# EAGLE design megatemp (EAGLE 6.1)
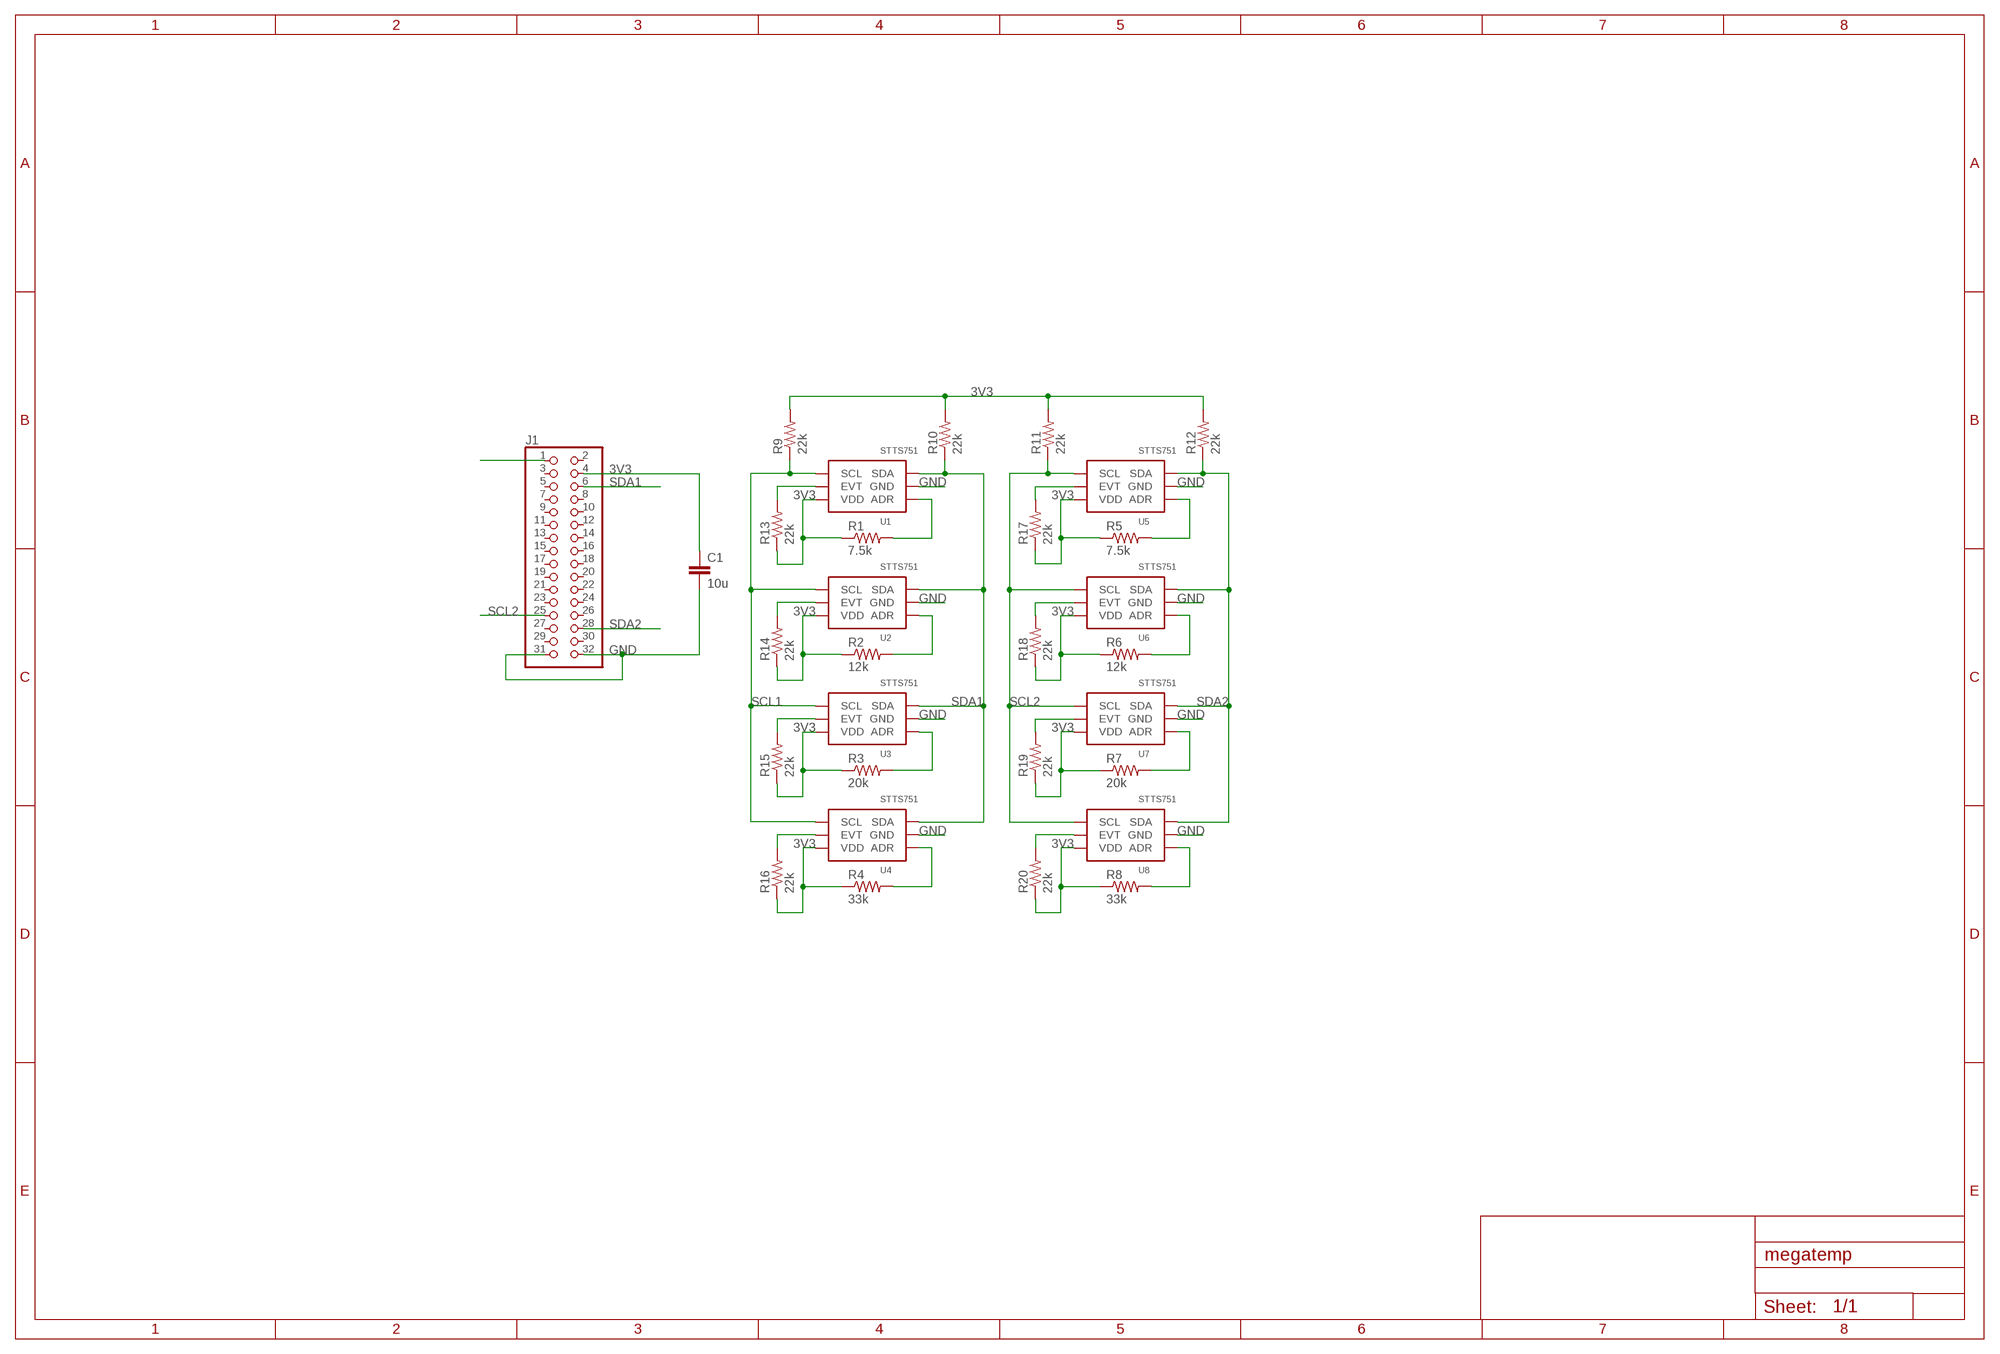
[diagram p0: schematic, sheet 1]

## Parts
C1  10u  C-EUC0805  [C0805]
J1  PINHD-2X16  [2X16]
R1  7.5k  R-US_R0402  [R0402]
R2  12k  R-US_R0402  [R0402]
R3  20k  R-US_R0402  [R0402]
R4  33k  R-US_R0402  [R0402]
R5  7.5k  R-US_R0402  [R0402]
R6  12k  R-US_R0402  [R0402]
R7  20k  R-US_R0402  [R0402]
R8  33k  R-US_R0402  [R0402]
R9  22k  R-US_R0402  [R0402]
R10  22k  R-US_R0402  [R0402]
R11  22k  R-US_R0402  [R0402]
R12  22k  R-US_R0402  [R0402]
R13  22k  R-US_R0402  [R0402]
R14  22k  R-US_R0402  [R0402]
R15  22k  R-US_R0402  [R0402]
R16  22k  R-US_R0402  [R0402]
R17  22k  R-US_R0402  [R0402]
R18  22k  R-US_R0402  [R0402]
R19  22k  R-US_R0402  [R0402]
R20  22k  R-US_R0402  [R0402]
U1  STTS751  [ST_UDFN-6L_2X2]
U2  STTS751  [ST_UDFN-6L_2X2]
U3  STTS751  [ST_UDFN-6L_2X2]
U4  STTS751  [ST_UDFN-6L_2X2]
U5  STTS751  [ST_UDFN-6L_2X2]
U6  STTS751  [ST_UDFN-6L_2X2]
U7  STTS751  [ST_UDFN-6L_2X2]
U8  STTS751  [ST_UDFN-6L_2X2]

## Nets
3V3: C1.1 J1.4 R1.1 R2.1 R3.1 R4.1 R5.1 R6.1 R7.1 R8.1 R9.2 R10.2 R11.2 R12.2 R13.1 R14.1 R15.1 R16.1 R17.1 R18.1 R19.1 R20.1 U1.3(VDD) U2.3(VDD) U3.3(VDD) U4.3(VDD) U5.3(VDD) U6.3(VDD) U7.3(VDD) U8.3(VDD)
GND: C1.2 J1.31 J1.32 U1.5(GND) U2.5(GND) U3.5(GND) U4.5(GND) U5.5(GND) U6.5(GND) U7.5(GND) U8.5(GND)
N$1: R13.2 U1.2(EVT)
N$2: R1.2 U1.4(ADR)
N$3: R2.2 U2.4(ADR)
N$4: R20.2 U8.2(EVT)
N$6: R3.2 U3.4(ADR)
N$7: R14.2 U2.2(EVT)
N$8: R4.2 U4.4(ADR)
N$9: R15.2 U3.2(EVT)
N$10: R8.2 U8.4(ADR)
N$11: R16.2 U4.2(EVT)
N$12: R7.2 U7.4(ADR)
N$13: R6.2 U6.4(ADR)
N$15: R19.2 U7.2(EVT)
N$16: R5.2 U5.4(ADR)
N$17: R18.2 U6.2(EVT)
N$18: R17.2 U5.2(EVT)
SCL1: J1.1 R9.1 U1.1(SCL) U2.1(SCL) U3.1(SCL) U4.1(SCL)
SCL2: J1.25 R11.1 U5.1(SCL) U6.1(SCL) U7.1(SCL) U8.1(SCL)
SDA1: J1.6 R10.1 U1.6(SDA) U2.6(SDA) U3.6(SDA) U4.6(SDA)
SDA2: J1.28 R12.1 U5.6(SDA) U6.6(SDA) U7.6(SDA) U8.6(SDA)
Unconnected: J1.2 J1.3 J1.5 J1.7 J1.8 J1.9 J1.10 J1.11 J1.12 J1.13 J1.14 J1.15 J1.16 J1.17 J1.18 J1.19 J1.20 J1.21 J1.22 J1.23 J1.24 J1.26 J1.27 J1.29 J1.30

## Library data of the parts
C1 = resistor:C-EU: CAPACITOR, European symbol
J1 = pinhead:PINHD-2X16: PIN HEADER
R1-R20 = resistor:R-US_: RESISTOR, American symbol
U1-U8 = megatemp:STTS751: ST STTS751 I2C Temperature Sensor

## Board
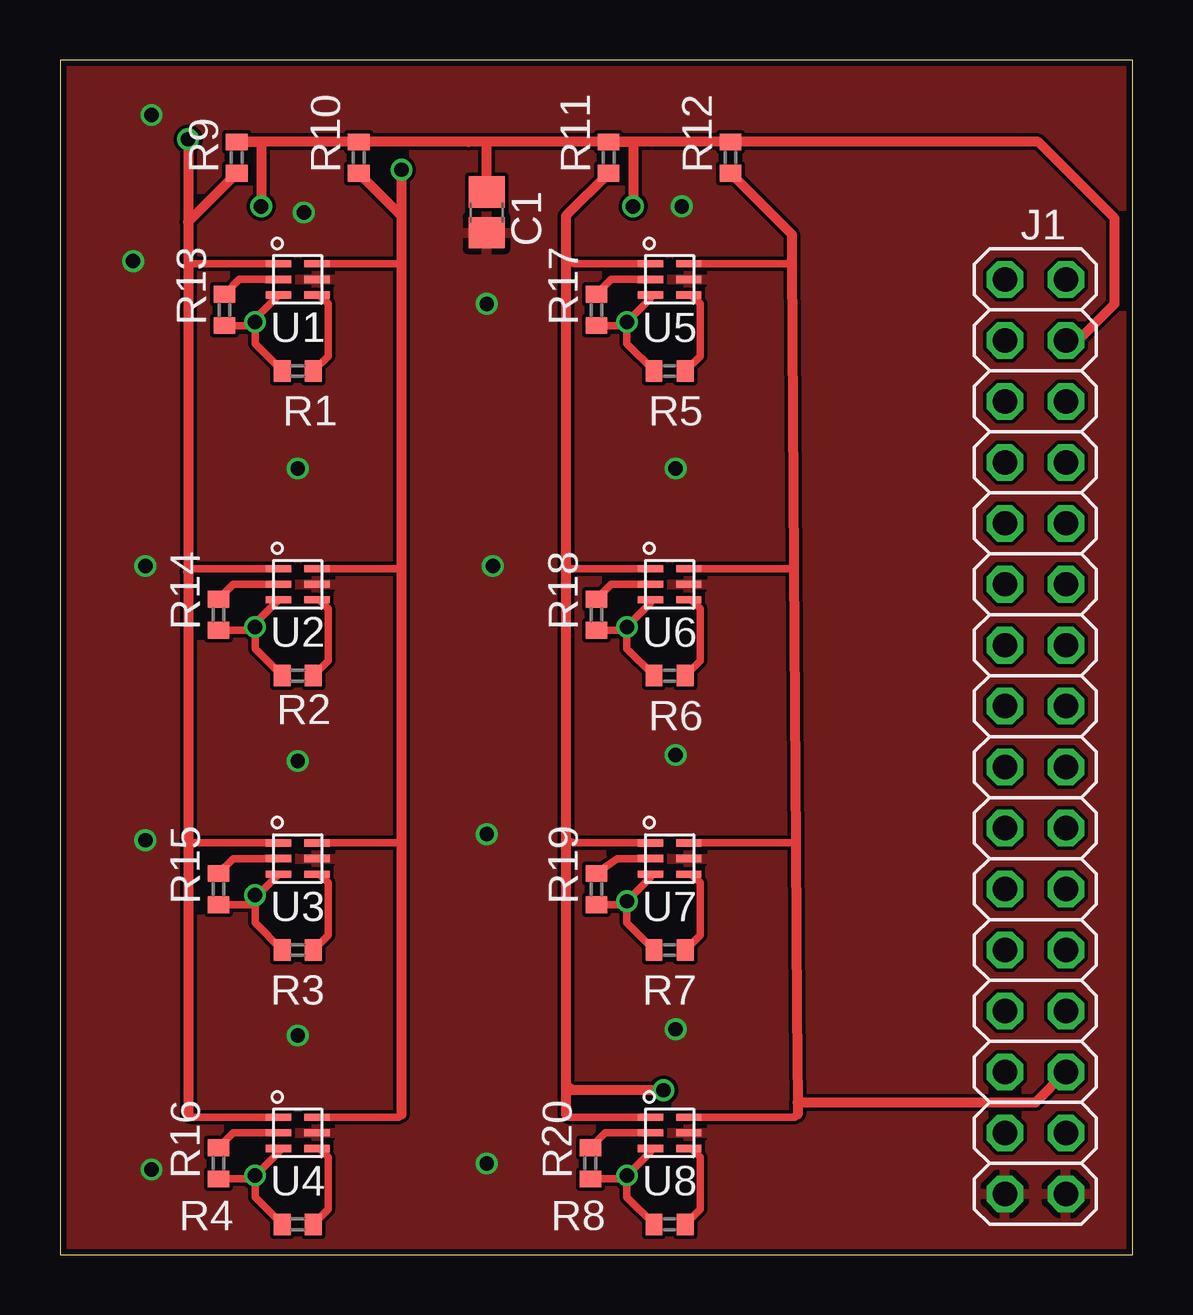
[diagram p1: board, top side]
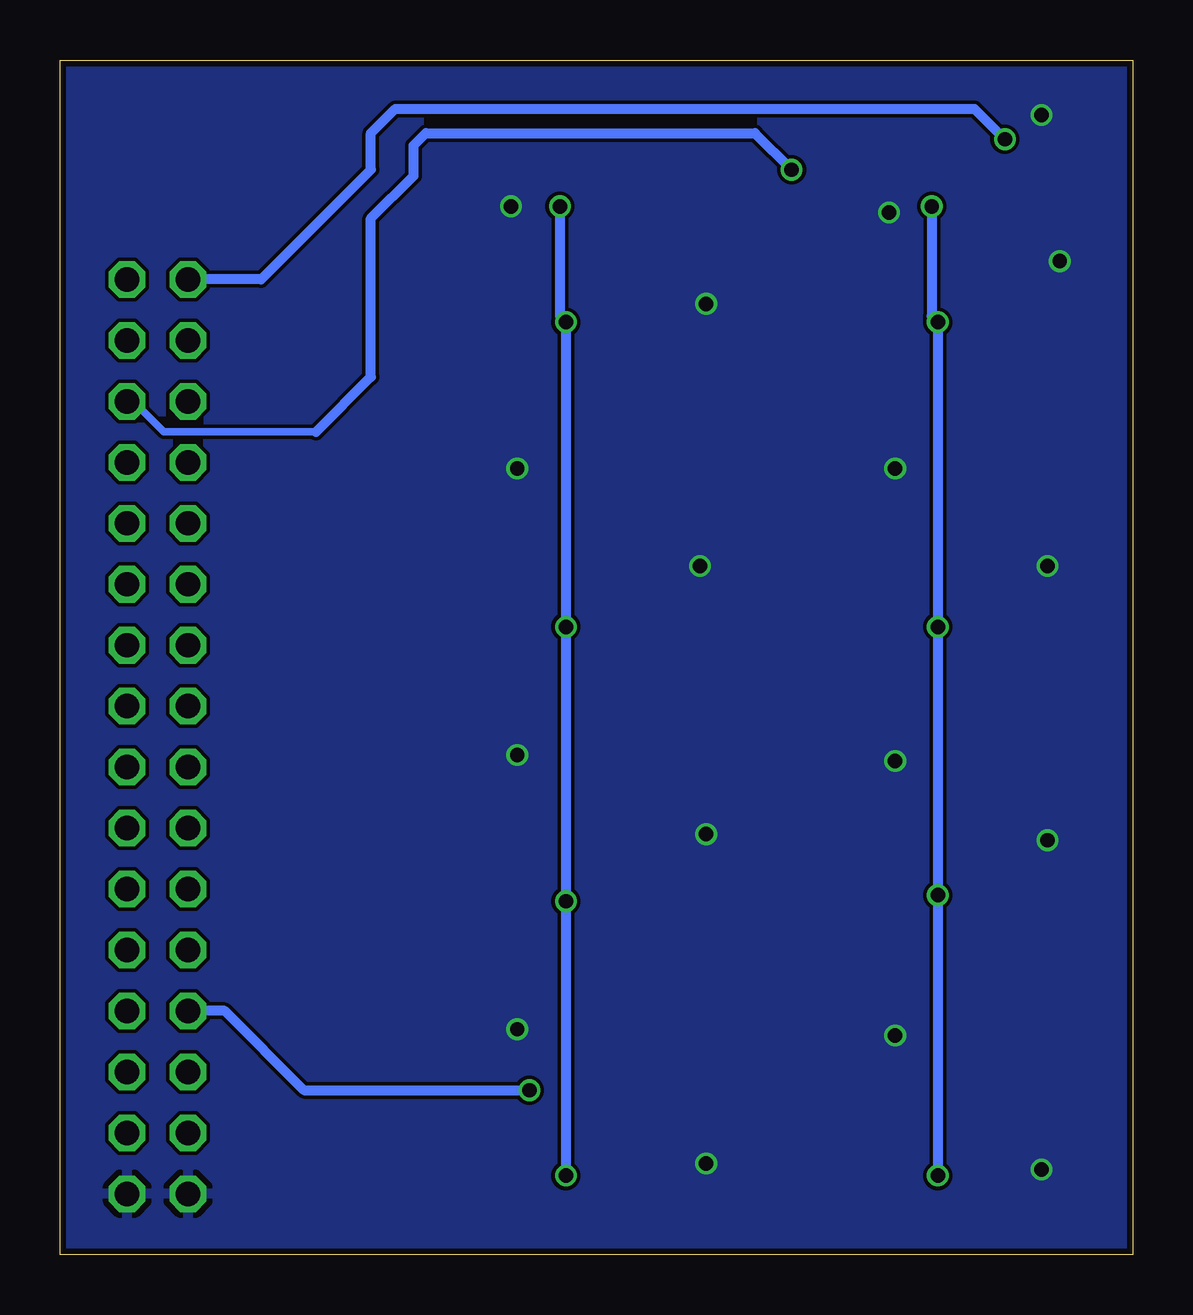
[diagram p2: board, bottom side, seen from below]

Size 44.7 x 49.78 mm. Coordinates in mm from the lower left corner, seen from the top.
Outline: 0,0 44.7,0 44.7,49.78 0,49.78 0,0
Copper layers (1*16): Top 0.035mm / dielectric 1.5mm / Bottom 0.035mm
Design rules: minimum track width 6mil, minimum drill 12mil, track to track 6mil, track to pad 6mil, pad to pad 6mil, via to via 6mil, smd to smd 0mil, copper to edge 10mil, drill to drill 10mil, minimum pad ring 10mil, minimum via ring 6mil, stop-mask expansion 2mil, vias tented up to drill 100mil, thermal gap 10mil

### Footprints (pad centres in the part's own frame; a part is rotated, then mirrored left to right if it is on the bottom)
C0805 = smd 1.3 x 1.5: 1 -0.85,0; 2 0.85,0
2X16 = drill 1.016 octagon: 1 -19.05,-1.27; 2 -19.05,1.27; 3 -16.51,-1.27; 4 -16.51,1.27; 5 -13.97,-1.27; 6 -13.97,1.27; 7 -11.43,-1.27; 8 -11.43,1.27; 9 -8.89,-1.27; 10 -8.89,1.27; 11 -6.35,-1.27; 12 -6.35,1.27; 13 -3.81,-1.27; 14 -3.81,1.27; 15 -1.27,-1.27; 16 -1.27,1.27; 17 1.27,-1.27; 18 1.27,1.27; 19 3.81,-1.27; 20 3.81,1.27; 21 6.35,-1.27; 22 6.35,1.27; 23 8.89,-1.27; 24 8.89,1.27; 25 11.43,-1.27; 26 11.43,1.27; 27 13.97,-1.27; 28 13.97,1.27; 29 16.51,-1.27; 30 16.51,1.27; 31 19.05,-1.27; 32 19.05,1.27
R0402 = smd 0.7 x 0.9: 1 -0.65,0; 2 0.65,0
ST_UDFN-6L_2X2 = smd 1.05 x 0.3: 1 -0.8,0.65; 2 -0.8,0; 3 -0.8,-0.65; 4 0.8,-0.65; 5 0.8,0; 6 0.8,0.65

### Placement (x,y rotation side)
C1  17.78,43.43 270 top
J1  40.64,21.59 270 top
R1  9.91,36.83 0 top
R2  9.91,24.13 0 top
R3  9.91,12.7 0 top
R4  9.91,1.27 0 top
R5  25.4,36.83 0 top
R6  25.4,24.13 0 top
R7  25.4,12.7 0 top
R8  25.4,1.27 0 top
R9  7.37,45.72 90 top
R10  12.45,45.72 90 top
R11  22.86,45.72 90 top
R12  27.94,45.72 90 top
R13  6.86,39.37 90 top
R14  6.6,26.67 90 top
R15  6.6,15.24 90 top
R16  6.6,3.81 90 top
R17  22.35,39.37 90 top
R18  22.35,26.67 90 top
R19  22.35,15.24 90 top
R20  22.1,3.81 90 top
U1  9.91,40.64 0 top
U2  9.91,27.94 0 top
U3  9.91,16.51 0 top
U4  9.91,5.08 0 top
U5  25.4,40.64 0 top
U6  25.4,27.94 0 top
U7  25.4,16.51 0 top
U8  25.4,5.08 0 top

### Tracks (layer width: path | path; a pad name or v marks a point on that pad's centre or on a via)
3V3  (via drill 0.6)
  Top 0.305: v8.13,38.86 8.13,39.01 U1.3 | v8.13,3.3 9.11,4.28 U4.3 | U3.3 8.23,14.99 v8.13,14.99 8.13,14.48 | U2.3 8.13,26.31 v8.13,26.16 | R2.1 8.13,25.26 v8.13,26.16 | R3.1 8.13,13.83 8.13,14.48 | v8.13,3.3 8.13,2.4 R4.1 | R1.1 8.13,37.96 v8.13,38.86 | R8.1 23.62,2.4 v23.62,3.3 | R15.1 8.02,14.59 8.13,14.48 | R14.1 7.99,26.02 v8.13,26.16 | R13.1 7.99,38.72 v8.13,38.86 | R16.1 7.99,3.16 v8.13,3.3 | R20.1 23.48,3.16 v23.62,3.3 | v23.62,3.3 24.6,4.28 U8.3 | v23.62,14.73 24.6,15.71 U7.3 | R7.1 23.62,13.83 v23.62,14.73 | R6.1 23.62,25.26 v23.62,26.16 | v23.62,26.16 24.6,27.14 U6.3 | v23.62,38.86 24.6,39.84 U5.3 | R5.1 23.62,37.96 v23.62,38.86 | R17.1 23.48,38.72 v23.62,38.86 | R18.1 23.48,26.02 v23.62,26.16 | R19.1 23.48,14.59 v23.62,14.73
  Top 0.406: J1.4 42.42,38.1 43.94,39.62 43.94,43.18 40.75,46.37 R12.2 R11.2 | R11.2 17.78,46.37 | v8.38,43.69 8.38,46.23 8.24,46.37 R9.2 R10.2 17.02,46.37 17.78,46.37 | R11.2 23.73,46.37 23.88,46.23 v23.88,43.69 | C1.1 17.78,46.37
  Bottom 0.406: v8.38,43.69 8.38,39.12 v8.13,38.86 v8.13,26.16 v8.13,14.99 v8.13,3.3 | v23.62,3.3 v23.62,14.73 v23.62,26.16 v23.62,38.86 23.88,39.12 v23.88,43.69
GND  (via drill 0.6)
  other vias: 17.78,17.53 9.91,20.57 9.91,9.14 9.91,32.77 25.65,32.77 25.65,20.83 25.65,9.4 10.16,43.43 25.91,43.69 3.81,47.5 3.56,28.7 3.56,17.27 3.81,3.56 18.03,28.7 17.78,39.62 3.05,41.4 17.78,3.81
  pour Bottom: 0,0 44.7,0 44.7,49.78 0,49.78
  pour Top: 0,0 44.7,0 44.7,49.78 0,49.78
N$1
  Top 0.305: U1.2 7.48,40.64 R13.2
N$2
  Top 0.305: R1.2 11.18,37.45 11.18,39.62 10.81,39.99 U1.4
N$3
  Top 0.305: R2.2 11.18,24.75 11.18,26.92 10.81,27.29 U2.4
N$4
  Top 0.305: U8.2 22.72,5.08 R20.2
N$6
  Top 0.305: R3.2 11.18,13.32 11.18,15.49 10.81,15.86 U3.4
N$7
  Top 0.305: U2.2 7.22,27.94 R14.2
N$8
  Top 0.305: R4.2 11.18,1.89 11.18,4.06 10.81,4.43 U4.4
N$9
  Top 0.305: U3.2 7.22,16.51 R15.2
N$10
  Top 0.305: R8.2 26.67,1.89 26.67,4.06 26.3,4.43 U8.4
N$11
  Top 0.305: U4.2 7.22,5.08 R16.2
N$12
  Top 0.305: R7.2 26.67,13.32 26.67,15.49 26.3,15.86 U7.4
N$13
  Top 0.305: R6.2 26.67,24.75 26.67,26.92 26.3,27.29 U6.4
N$15
  Top 0.305: U7.2 23.23,16.51 R19.2
N$16
  Top 0.305: R5.2 26.67,37.45 26.67,39.62 26.3,39.99 U5.4
N$17
  Top 0.305: U6.2 22.97,27.94 R18.2
N$18
  Top 0.305: U5.2 22.97,40.64 R17.2
SCL1  (via drill 0.6)
  Top 0.305: U1.1 5.48,41.29 5.33,41.15 | U2.1 5.48,28.59 5.33,28.45 | U3.1 5.45,17.16 5.33,17.27 | U4.1 5.45,5.73 5.33,5.84
  Top 0.406: R9.1 5.33,43.04 | 5.33,43.04 5.33,41.15 5.33,28.45 5.33,17.27 5.33,5.84 | v5.33,46.48 5.33,43.04
  Bottom 0.406: v5.33,46.48 6.6,47.75 30.73,47.75 31.75,46.74 31.75,45.21 36.32,40.64 J1.1
SCL2  (via drill 0.6)
  Top 0.305: 21.08,5.84 21.19,5.73 U8.1 | U7.1 21.45,17.16 21.08,17.27 | U6.1 21.22,28.59 21.08,28.45 | U5.1 21.45,41.29 21.08,41.4
  Top 0.406: R11.1 21.08,43.29 21.08,41.4 21.08,28.45 21.08,17.27 21.08,7.11 | 21.08,7.11 21.08,5.84 | v25.15,6.86 21.34,6.86 21.08,7.11
  Bottom 0.406: v25.15,6.86 34.54,6.86 37.85,10.16 J1.25
SDA1  (via drill 0.6)
  Top 0.305: U4.6 14.11,5.73 14.22,5.84 | U3.6 14.08,17.16 14.22,17.02 | U2.6 14.08,28.59 14.22,28.45 | U1.6 14.08,41.29 14.22,41.15
  Top 0.406: R10.1 14.22,43.29 | 14.22,43.29 14.22,41.15 14.22,28.45 14.22,17.02 14.22,5.84 | v14.22,45.21 14.22,43.29
  Bottom 0.305: J1.6 41.66,35.56 40.39,34.29 34.04,34.29
  Bottom 0.406: 34.04,34.29 31.75,36.58 31.75,43.18 29.97,44.96 29.97,46.23 29.46,46.74 15.75,46.74 v14.22,45.21
SDA2
  Top 0.305: U5.6 30.38,41.29 30.49,41.4 | U6.6 30.47,28.59 30.58,28.7 | U7.6 30.52,17.16 30.66,17.02 | U8.6 30.62,5.73 30.73,5.84
  Top 0.406: R12.1 30.48,42.53 30.49,41.4 30.58,28.7 30.66,17.02 30.7,10.16 | 30.7,10.16 30.73,6.35 | 30.73,6.35 30.73,5.84 | 30.7,10.16 | J1.28 40.64,6.35 30.73,6.35

### Text on the board
tDocu: STTS751 | P2 -> | GND ->